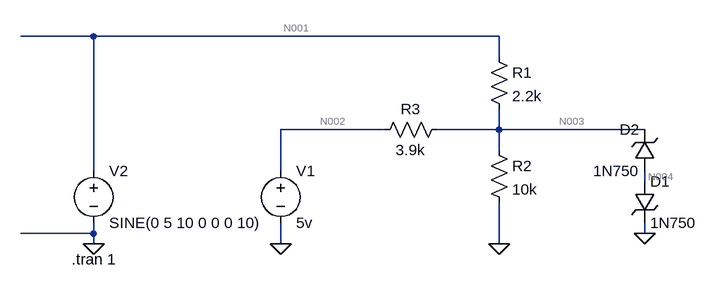
[diagram p0: schematic Draft1.asc]
Draft1.asc, the LTspice schematic file:
Version 4
SHEET 1 880 680
WIRE -320 -32 -432 -32
WIRE 304 -32 -320 -32
WIRE 304 0 304 -32
WIRE 128 112 -32 112
WIRE 304 112 304 80
WIRE 304 112 208 112
WIRE 528 112 304 112
WIRE 304 144 304 112
WIRE -320 176 -320 -32
WIRE -32 176 -32 112
WIRE 528 192 528 176
WIRE -320 272 -320 256
WIRE -320 272 -432 272
WIRE 528 272 528 256
WIRE -320 288 -320 272
WIRE -32 288 -32 256
WIRE 304 288 304 224
FLAG -32 288 0
FLAG -320 288 0
FLAG 304 288 0
FLAG 528 272 0
SYMBOL voltage -32 160 R0
WINDOW 123 0 0 Left 0
WINDOW 39 0 0 Left 0
SYMATTR InstName V1
SYMATTR Value 5v
SYMBOL voltage -320 160 R0
WINDOW 123 0 0 Left 0
WINDOW 39 0 0 Left 0
SYMATTR InstName V2
SYMATTR Value SINE(0 5 10 0 0 0 10)
SYMBOL res 288 -16 R0
SYMATTR InstName R1
SYMATTR Value 2.2k
SYMBOL res 288 128 R0
SYMATTR InstName R2
SYMATTR Value 10k
SYMBOL res 224 96 R90
WINDOW 0 0 56 VBottom 2
WINDOW 3 32 56 VTop 2
SYMATTR InstName R3
SYMATTR Value 3.9k
SYMBOL zener 512 192 R0
SYMATTR InstName D1
SYMATTR Value 1N750
SYMATTR Description Diode
SYMATTR Type diode
SYMBOL zener 544 176 R180
WINDOW 0 24 64 Left 2
WINDOW 3 24 0 Left 2
SYMATTR InstName D2
SYMATTR Value 1N750
SYMATTR Description Diode
SYMATTR Type diode
TEXT -354 312 Left 2 !.tran 1

The netlist it stands for:
* Draft1.asc
V1 N002 0 5v
V2 N001 0 SINE(0 5 10 0 0 0 10)
R1 N001 N003 2.2k
R2 N003 0 10k
R3 N003 N002 3.9k
D1 N004 0 1N750
D2 N004 N003 1N750
.model D D
.lib standard.dio
.tran 1
.backanno
.end

* Results of the author's LTspice run, read from the files saved beside the schematic
* Operating Point, zero values left out:
*   V(n002) = 5 V
*   V(n003) = 1.581 V
*   V(n004) = 275.6 mV
*   I(D2) = -302.8 nA
*   I(D1) = 302.8 nA
*   I(R3) = -876.8 µA
*   I(R2) = 158.1 µA
*   I(R1) = -718.4 µA
*   I(V2) = 718.4 µA
*   I(V1) = -876.8 µA
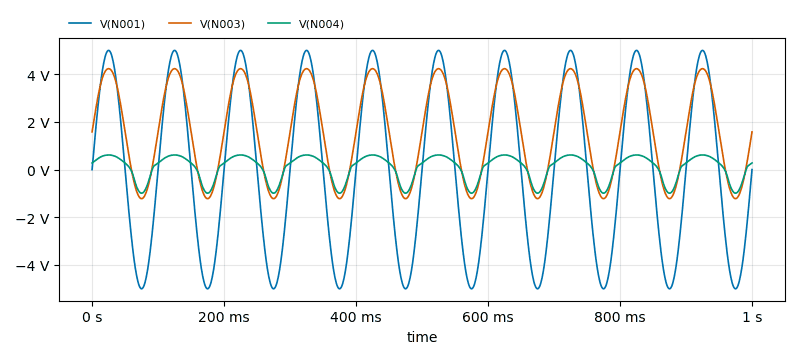
[diagram p1: Transient Analysis of Draft1.asc, plotted from the saved traces]
* Transient Analysis, 1 run:
*   V(N001): min -5 V, max 5 V, average -5.049 µV, rms 3.536 V, last 0 V
*   V(N003): min -1.219 V, max 4.232 V, average 1.554 V, rms 2.49 V, last 1.581 V
*   V(N004): min -990.1 mV, max 611.9 mV, average 78.66 mV, rms 536.3 mV, last 277.3 mV